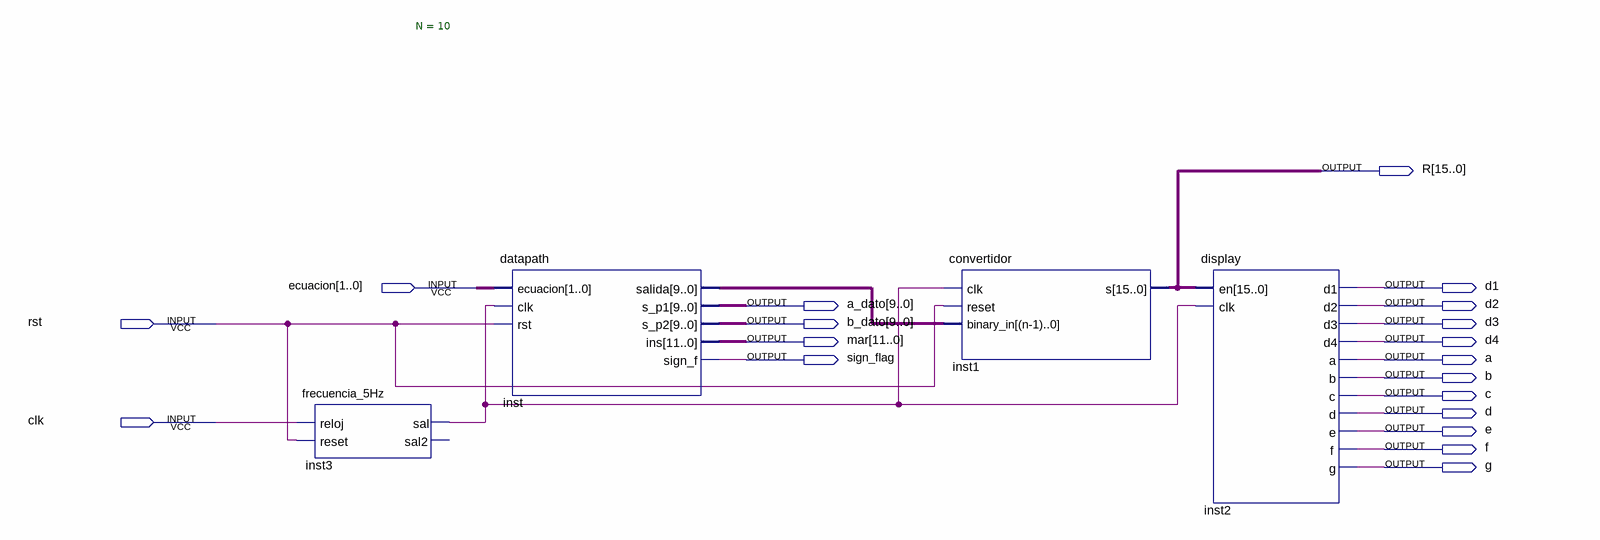
[diagram p0: schematic sheet]
// Quartus schematic practica2.bdf as structural Verilog: 4 symbols, 19 pins
module practica2 (
  input  [1:0] ecuacion,
  input  rst,
  input  clk,
  output [15:0] R,
  output d1,
  output [9:0] a_dato,
  output d2,
  output [9:0] b_dato,
  output d3,
  output [11:0] mar,
  output d4,
  output sign_flag,
  output a,
  output b,
  output c,
  output d,
  output e,
  output f,
  output g
);

  wire inst3_sal;
  wire [9:0] inst_salida;

  frecuencia_5Hz inst3 (.reloj(clk), .reset(rst), .sal(inst3_sal));  // open: sal2
  datapath inst (
    .ecuacion(ecuacion), .clk(inst3_sal), .rst(rst), .salida(inst_salida), .s_p1(a_dato), .s_p2(b_dato),
    .ins(mar), .sign_f(sign_flag));
  convertidor #(.N(10)) inst1 (.clk(inst3_sal), .reset(rst), .binary_in(inst_salida), .s(R));
  display inst2 (
    .en(R), .clk(inst3_sal), .d1(d1), .d2(d2), .d3(d3), .d4(d4), .a(a), .b(b), .c(c), .d(d), .e(e), .f(f),
    .g(g));
endmodule
